# Altium project MB1364.PrjPcb (part 3 of 3)

## Sheet ST_LINK_V3E.SchDoc: STLINK_V3E
size A3; Date: Not used; ApprovedBy: Not used; CheckedBy: Not used; Author: Not used; CompanyName: STMicroelectronics; DrawnBy: Not used; Engineer: Not used; Organization: Not used; Address1: Not used; Address2: Not used; Address3: Not used; Address4: Not used; DocumentNumber: 10; Revision: Not used; SheetNumber: 9; SheetTotal: 9; CurrentTime: Not used; CurrentDate: Not used; Time: Not used; DocumentFullPathAndName: Not used; DocumentName: Not used; ModifiedDate: Not used; ImagePath: Not used; ProjectName: Not used; Application_BuildNumber: Not used
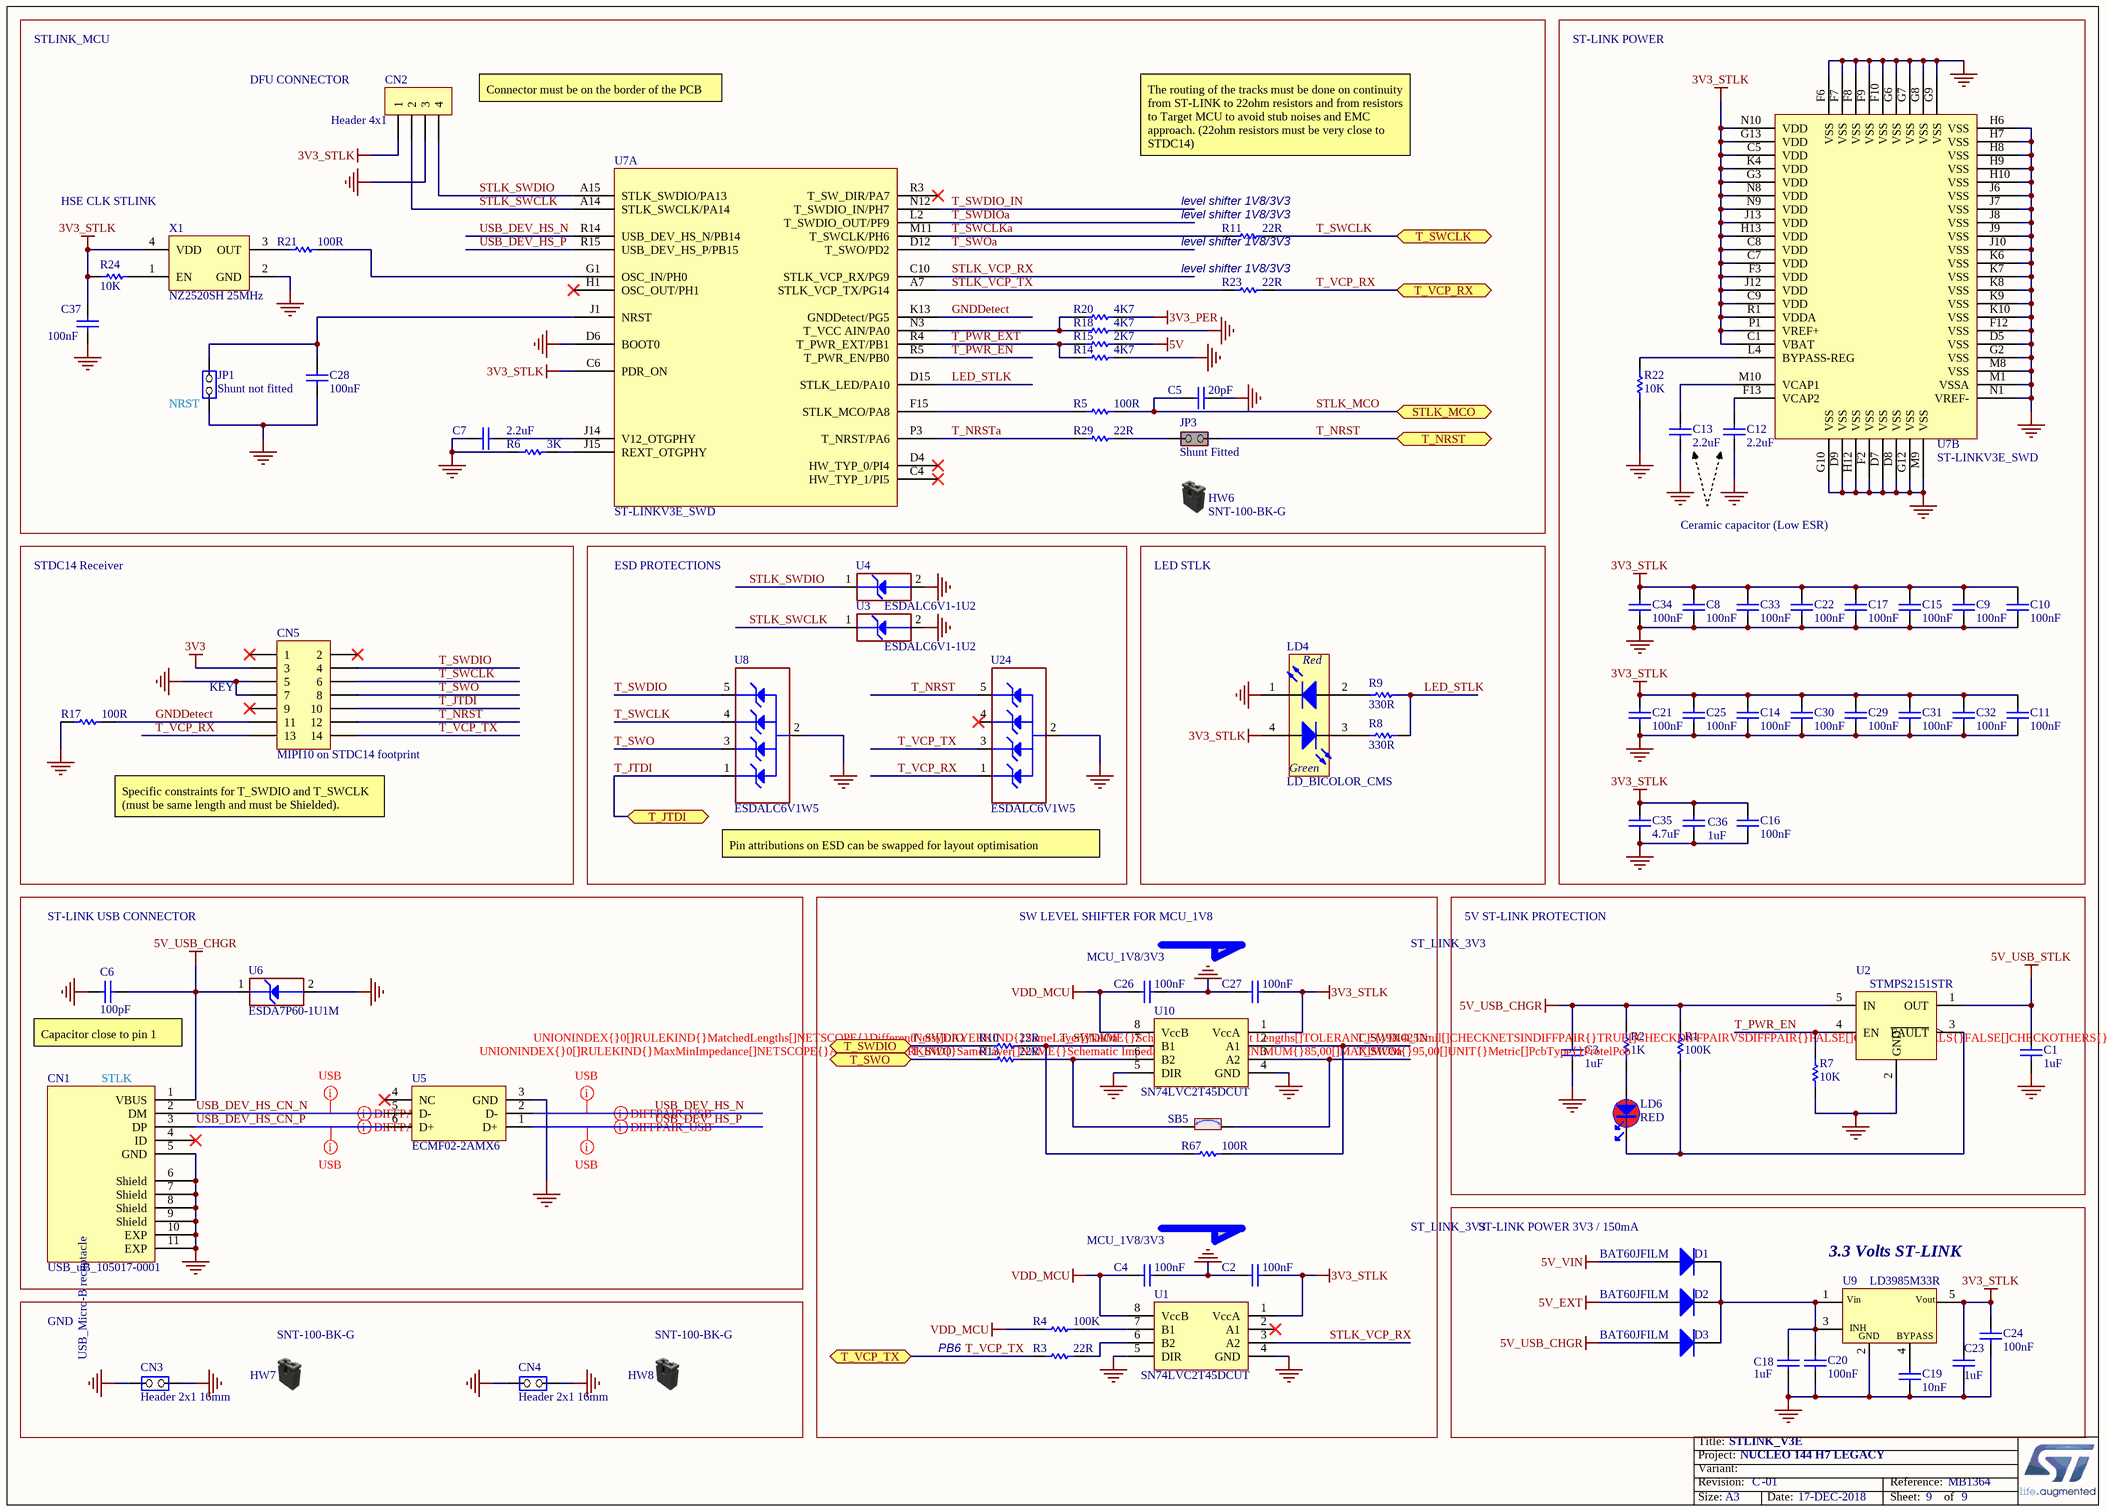
[diagram p8: ST_LINK_V3E.SchDoc]

### Parts
C1  value 1uF  [C0603]  (hidden comment: Capacitor)
C2  value 100nF  [C0603]  (hidden comment: Capacitor)
C3  value 1uF  [C0603]  (hidden comment: Capacitor)
C4  value 100nF  [C0603]  (hidden comment: Capacitor)
C5  value 20pF  [C0402]  (hidden comment: Capacitor)
C6  value 100pF  [C0402]  (hidden comment: Capacitor)
C7  value 2.2uF  [C0603]  (hidden comment: Capacitor)
C8  value 100nF  [C0402]  (hidden comment: Capacitor)
C9  value 100nF  [C0402]  (hidden comment: Capacitor)
C10  value 100nF  [C0402]  (hidden comment: Capacitor)
C11  value 100nF  [C0402]  (hidden comment: Capacitor)
C12  value 2.2uF  [C0603]  (hidden comment: Capacitor)
C13  value 2.2uF  [C0603]  (hidden comment: Capacitor)
C14  value 100nF  [C0402]  (hidden comment: Capacitor)
C15  value 100nF  [C0402]  (hidden comment: Capacitor)
C16  value 100nF  [C0402]  (hidden comment: Capacitor)
C17  value 100nF  [C0402]  (hidden comment: Capacitor)
C18  value 1uF  [C0603]  (hidden comment: Capacitor)
C19  value 10nF  [C0402]  (hidden comment: Capacitor)
C20  value 100nF  [C0402]  (hidden comment: Capacitor)
C21  value 100nF  [C0402]  (hidden comment: Capacitor)
C22  value 100nF  [C0402]  (hidden comment: Capacitor)
C23  value 1uF  [C0603]  (hidden comment: Capacitor)
C24  value 100nF  [C0402]  (hidden comment: Capacitor)
C25  value 100nF  [C0402]  (hidden comment: Capacitor)
C26  value 100nF  [C0603]  (hidden comment: Capacitor)
C27  value 100nF  [C0603]  (hidden comment: Capacitor)
C28  value 100nF  [C0402]  (hidden comment: Capacitor)
C29  value 100nF  [C0402]  (hidden comment: Capacitor)
C30  value 100nF  [C0402]  (hidden comment: Capacitor)
C31  value 100nF  [C0402]  (hidden comment: Capacitor)
C32  value 100nF  [C0402]  (hidden comment: Capacitor)
C33  value 100nF  [C0402]  (hidden comment: Capacitor)
C34  value 100nF  [C0402]  (hidden comment: Capacitor)
C35  value 4.7uF  [C0603]  (hidden comment: Capacitor)
C36  value 1uF  [C0603]  (hidden comment: Capacitor)
C37  value 100nF  [C0402]  (hidden comment: Capacitor)
CN1  value USB_uB_105017-0001  [CON_USBMICROB_MOLEX_105017-0001_H2P90]  (hidden comment: USB_uB_105017.0001)
CN2  Header 4x1  [CON_SAMTEC_TSW-104-07-G-S]
CN3  value Header 2x1 16mm  [CON_SAMTEC_TSW-102-09-X-S]  (hidden comment: Jumper_Header 2x1)
CN4  value Header 2x1 16mm  [CON_SAMTEC_TSW-102-09-X-S]  (hidden comment: Jumper_Header 2x1)
CN5  value MIPI10 on STDC14 footprint  [CON_STDC14_Receiver_MEDIUM_WITH_MIPI10_3D]  (hidden comment: Header 7x2)
D1  BAT60JFILM  [DIO_SOD323]
D2  BAT60JFILM  [DIO_SOD323]
D3  BAT60JFILM  [DIO_SOD323]
HW6  value SNT-100-BK-G  (hidden comment: Shunt Black 2.54mm)  (mechanical)
HW7  value SNT-100-BK-G  (hidden comment: Shunt Black 2.54mm)  (mechanical)
HW8  value SNT-100-BK-G  (hidden comment: Shunt Black 2.54mm)  (mechanical)
JP1  value Shunt not fitted  [CON_SAMTEC_TSW-102-07-G-S]  (hidden comment: Jumper_Header 2x1)
JP3  value Shunt Fitted  [CON_SAMTEC_TSW-102-07-G-S]  (hidden comment: Jumper_Header 2x1 Fitted)
LD4  LD_BICOLOR_CMS  [LED_BI-GR_HSMF-A201-A00J1]
LD6  value RED  [LED_0603_RED]  (hidden comment: LED_red)
R1  value 100K  [R0603]  (hidden comment: Resistor)
R2  value 1K  [R0603]  (hidden comment: Resistor)
R3  value 22R  [R0402]  (hidden comment: Resistor)
R4  value 100K  [R0603]  (hidden comment: Resistor)
R5  value 100R  [R0402]  (hidden comment: Resistor)
R6  value 3K  [R0402]  (hidden comment: Resistor)
R7  value 10K  [R0603]  (hidden comment: Resistor)
R8  value 330R  [R0603]  (hidden comment: Resistor)
R9  value 330R  [R0603]  (hidden comment: Resistor)
R10  value 22R  [R0402]  (hidden comment: Resistor)
R11  value 22R  [R0402]  (hidden comment: Resistor)
R13  value 22R  [R0402]  (hidden comment: Resistor)
R14  value 4K7  [R0402]  (hidden comment: Resistor)
R15  value 2K7  [R0402]  (hidden comment: Resistor)
R17  value 100R  [R0402]  (hidden comment: Resistor)
R18  value 4K7  [R0402]  (hidden comment: Resistor)
R20  value 4K7  [R0402]  (hidden comment: Resistor)
R21  value 100R  [R0402]  (hidden comment: Resistor)
R22  value 10K  [R0402]  (hidden comment: Resistor)
R23  value 22R  [R0402]  (hidden comment: Resistor)
R24  value 10K  [R0402]  (hidden comment: Resistor)
R29  value 22R  [R0402]  (hidden comment: Resistor)
R67  value 100R  [R0402]  (hidden comment: Resistor)
SB5  SB_ON  [SOLDER-BRIDGE_R0603-0R]  (value not drawn)
U1  SN74LVC2T45DCUT  [ICC_VSSOP8_DCU_R-PDSO-G8_2X2P30_P050]
U2  STMPS2151STR  [MOS_SOT23-5L]
U3  value ESDALC6V1-1U2  [ESD_ST0201]  (hidden comment: ESD-TRANSIL)
U4  value ESDALC6V1-1U2  [ESD_ST0201]  (hidden comment: ESD-TRANSIL)
U5  ECMF02-2AMX6  [ESD_QFN-6L_1P7X1P5_P050]
U6  value ESDA7P60-1U1M  [ESD_QFN2_1P6X1_P125]  (hidden comment: ESD-TRANSIL)
U7  ST-LINKV3E_SWD  [ICC_UFBGA201_176+25_10X10_P065]  (parts A,B of 2)
U8  ESDALC6V1W5  [ESD_SOT323-5L]
U9  LD3985M33R  [REG_SOT23-5L]
U10  SN74LVC2T45DCUT  [ICC_VSSOP8_DCU_R-PDSO-G8_2X2P30_P050]
U24  ESDALC6V1W5  [ESD_SOT323-5L]
X1  value NZ2520SH 25MHz  [OSC_NDK_NZ2520SB_4P]  (hidden comment: OSCILLATOR_4_PINS)

### Blocks framed on the sheet
ESD PROTECTIONS: U3 U4 U8 U24
LED STLK: LD4 R8 R9
5V ST-LINK PROTECTION: C1 C3 LD6 R1 R2 R7 U2
3.3 Volts ST-LINK: C18-C20 C23 C24 D1-D3 U9
GND: CN3 CN4 HW7 HW8

### Ports
STLK_MCO, T_JTDI (bidir), T_NRST, T_SWCLK, T_SWDIO, T_SWO, T_VCP_RX, T_VCP_TX

### Nets
3V3: CN5.3
3V3_PER: R20.2
3V3_STLK: C2.2 C8.2 C9.2 C10.2 C11.2 C14.2 C15.2 C16.2 C17.2 C21.2 C22.2 C23.2 C24.2 C25.2 C27.2 C29.2 C30.2 C31.2 C32.2 C33.2 C34.2 C35.2 C36.2 C37.2 CN2.1 LD4.4(YellowGreen_anode) R24.1 U1.1(VccA) U7.C1(VBAT) U7.C5(VDD) U7.C6(PDR_ON) U7.C7(VDD) U7.C8(VDD) U7.C9(VDD) U7.F3(VDD) U7.G3(VDD) U7.G13(VDD) U7.H13(VDD) U7.J12(VDD) U7.J13(VDD) U7.K4(VDD) U7.N8(VDD) U7.N9(VDD) U7.N10(VDD) U7.P1(VREF+) U7.R1(VDDA) U9.5(Vout) U10.1(VccA) X1.4(VDD)
5V: R15.1
5V_EXT: D2.1(A)
5V_USB_CHGR: C3.2 C6.2 CN1.1(VBUS) D3.1(A) R1.2 R2.2 U2.5(IN) U6.1(IO1)
5V_USB_STLK: C1.2 U2.1(OUT)
5V_VIN: D1.1(A)
GND: C1.1 C2.1 C3.1 C4.2 C5.1 C6.1 C7.1 C8.1 C9.1 C10.1 C11.1 C12.1 C13.1 C14.1 C15.1 C16.1 C17.1 C18.2 C19.1 C20.1 C21.1 C22.1 C23.1 C24.1 C25.1 C26.2 C27.1 C28.1 C29.1 C30.1 C31.1 C32.1 C33.1 C34.1 C35.1 C36.1 C37.1 CN1.5(GND) CN1.6(Shield) CN1.7(Shield) CN1.8(Shield) CN1.9(Shield) CN1.10(EXP) CN1.11(EXP) CN2.3 CN3.1(COMMON) CN3.2(NO) CN4.1(COMMON) CN4.2(NO) CN5.5 CN5.7 JP1.1(COMMON) LD4.1(RED_cathode) R6.1 R7.2 R14.1 R17.1 R18.2 R22.1 U1.4(GND) U1.5(DIR) U2.2(GND) U3.2(GND) U4.2(GND) U5.3(GND) U6.2(GND) U7.D5(VSS) U7.D6(BOOT0) U7.D7(VSS) U7.D8(VSS) U7.D9(VSS) U7.F2(VSS) U7.F6(VSS) U7.F7(VSS) U7.F8(VSS) U7.F9(VSS) U7.F10(VSS) U7.F12(VSS) U7.G2(VSS) U7.G6(VSS) U7.G7(VSS) U7.G8(VSS) U7.G9(VSS) U7.G10(VSS) U7.G12(VSS) U7.H6(VSS) U7.H7(VSS) U7.H8(VSS) U7.H9(VSS) U7.H10(VSS) U7.H12(VSS) U7.J6(VSS) U7.J7(VSS) U7.J8(VSS) U7.J9(VSS) U7.J10(VSS) U7.K6(VSS) U7.K7(VSS) U7.K8(VSS) U7.K9(VSS) U7.K10(VSS) U7.M1(VSSA) U7.M8(VSS) U7.M9(VSS) U7.N1(VREF-) U8.2(GND) U9.2(GND) U10.4(GND) U10.5(DIR) U24.2(GND) X1.2(GND)
VDD_MCU: C4.1 C26.1 R4.1 U1.8(VccB) U10.8(VccB)
GNDDetect: CN5.11 R17.2 U7.K13(GNDDetect/PG5)
LED_STLK: R8.2 R9.2 U7.D15(STLK_LED/PA10)
STLK_MCO: C5.2 R5.2 ; port STLK_MCO
STLK_SWCLK: CN2.2 U3.1(IO1) U7.A14(STLK_SWCLK/PA14)
STLK_SWDIO: CN2.4 U4.1(IO1) U7.A15(STLK_SWDIO/PA13)
STLK_VCP_RX: U1.3(A2) U7.C10(STLK_VCP_RX/PG9)
STLK_VCP_TX: R23.1 U7.A7(STLK_VCP_TX/PG14)
T_JTDI: CN5.10 U8.1(IO1) ; port T_JTDI  [project net PA15]
T_NRST: CN5.12 JP3.2(NO) U24.5(IO4) ; port T_NRST
T_NRSTa: R29.1 U7.P3(T_NRST/PA6)
T_PWR_EN: R7.1 U2.4(EN) U7.R5(T_PWR_EN/PB0)
T_PWR_EXT: R14.2 R15.2 U7.R4(T_PWR_EXT/PB1)
T_SWCLK: CN5.6 R11.2 U8.4(IO3) ; port T_SWCLK
T_SWCLKa: R11.1 U7.M11(T_SWCLK/PH6)
T_SWDIO: CN5.4 R10.1 U8.5(IO4) ; port T_SWDIO
T_SWDIO_IN: R67.2 U7.N12(T_SWDIO_IN/PH7) U10.2(A1)
T_SWDIOa: R10.2 R67.1 U7.L2(T_SWDIO_OUT/PF9) U10.7(B1)
T_SWO: CN5.8 R13.1 U8.3(IO2) ; port T_SWO
T_SWOa: SB5.1 U7.D12(T_SWO/PD2) U10.3(A2)
T_VCP_RX: CN5.13 R23.2 U24.1(IO1) ; port T_VCP_RX
T_VCP_TX: CN5.14 R3.1 U24.3(IO2) ; port T_VCP_TX
USB_DEV_HS_CN_N: CN1.2(DM) U5.5(D-)
USB_DEV_HS_CN_P: CN1.3(DP) U5.6(D+)
USB_DEV_HS_N: U5.2(D-) U7.R14(USB_DEV_HS_N/PB14)
USB_DEV_HS_P: U5.1(D+) U7.R15(USB_DEV_HS_P/PB15)
NetC7_2: C7.2 U7.J14(V12_OTGPHY)
NetC12_2: C12.2 U7.F13(VCAP2)
NetC13_2: C13.2 U7.M10(VCAP1)
NetC18_1: C18.1 C20.2 D1.2(K) D2.2(K) D3.2(K) U9.1(Vin) U9.3(CE)
NetC19_2: C19.2 U9.4(BYPASS)
NetC28_2: C28.2 JP1.2(NO) U7.J1(NRST)
NetJP3_1: JP3.1(COMMON) R29.2
NetLD4_2: LD4.2(Red_anode) R9.1
NetLD4_3: LD4.3(YellowGreen_cathode) R8.1
NetLD6_1: LD6.1 R2.1
NetLD6_2: LD6.2 R1.1 U2.3(~{FAULT})
NetR3_2: R3.2 U1.6(B2)
NetR4_2: R4.2 U1.7(B1)
NetR5_1: R5.1 U7.F15(STLK_MCO/PA8)
NetR6_2: R6.2 U7.J15(REXT_OTGPHY)
NetR13_2: R13.2 SB5.2 U10.6(B2)
NetR18_1: R18.1 R20.1 U7.N3(T_VCC_AIN/PA0)
NetR21_1: R21.1 X1.3(OUT)
NetR21_2: R21.2 U7.G1(OSC_IN/PH0)
NetR22_2: R22.2 U7.L4(BYPASS-REG)
NetR24_2: R24.2 X1.1(EN)

Not connected (* = marked no-connect by the designer): CN1 4(ID)*; CN5 1* 2* 9*; U1 2(A1)*; U5 4(NC)*; U7 C4(HW_TYP_1/PI5)* D4(HW_TYP_0/PI4)* H1(OSC_OUT/PH1)* R3(T_SW_DIR/PA7)*; U24 4(IO3)*

### Layout directives
differential pair; rule Impedance Constraint [Min = 85.00    Max = 95.00    ]: USB_DEV_HS_CN_N, USB_DEV_HS_CN_P, USB_DEV_HS_N, USB_DEV_HS_P
rule Undefined; rule Matched Net Lengths [Tolerance = 2.5mm]; rule Impedance Constraint [Min = 85.00    Max = 95.00    ]: USB_DEV_HS_N
rule Undefined; rule Matched Net Lengths [Tolerance = 0.2mm]; rule Impedance Constraint [Min = 85.00    Max = 95.00    ]: USB_DEV_HS_CN_N, USB_DEV_HS_CN_P, USB_DEV_HS_P

### Notes on the sheet
- STLINK_MCU
- ST-LINK POWER
- DFU CONNECTOR
- (near CN2) Connector must be on the border of the PCB
- The routing of the tracks must be done on continuity from ST-LINK to 22ohm resistors and from resistors to Target MCU to avoid stub noises and EMC approach. (22ohm resistors must be very close to STDC14)
- HSE CLK STLINK
- level shifter 1V8/3V3
- (near JP1) NRST
- STDC14 Receiver
- Ceramic capacitor (Low ESR)
- (near CN5) KEY
- Specific constraints for T_SWDIO and T_SWCLK (must be same length and must be Shielded).
- Pin attributions on ESD can be swapped for layout optimisation
- ST-LINK USB CONNECTOR
- SW LEVEL SHIFTER FOR MCU_1V8
- MCU_1V8/3V3
- ST_LINK_3V3
- (near C6) Capacitor close to pin 1
- (near CN1) STLK
- ST-LINK POWER 3V3 / 150mA
- PB6
- Title:
- Project:
- Size:
- Revision:
- Variant:
- A3
- -
- Date:
- Reference:
- Sheet:
- of
- (in symbol MCD-00028) USB_Micro-B receptacle
- (in symbol MCD-00051) Red; Green
- (in symbol MCD-00086) INH

### Library data of the parts
C1 C3 C18 = MCD-00238: Capacitor, MLCC, 1uF, 6V3, X5R, 10%, 0603, T=0,8mm; Manufacturer_Part_Number: CC0603KRX5R5BB105; Manufacturer: YAGEO; Provided_By: SUBCO; ECCN_US: EAR99; ECCN_EU: NEC; Internal_Part_Number: MCD-00238; ComponentLink1Description: Datasheet; Status: Released; Part_Type: Capacitor; Package: C0603; ComponentLink1URL: http://tunmcdsvn.tun.st.com/Component_Datasheet_Library/Trunk/Capacitors/Yageo_Multilayer_capacitor_X5R_series_100pF_to_100uF
C2 C4 C26 C27 = MCD-00237: Capacitor, MLCC, 100nF, 6V3, X5R, 10%, 0603, T=0,8mm; Manufacturer_Part_Number: CC0603KRX5R5BB104; Manufacturer: YAGEO; Provided_By: SUBCO; ECCN_US: EAR99; ECCN_EU: NEC; Internal_Part_Number: MCD-00237; ComponentLink1Description: Datasheet; Status: Released; Part_Type: Capacitor; Package: C0603; ComponentLink1URL: http://tunmcdsvn.tun.st.com/Component_Datasheet_Library/Trunk/Capacitors/Yageo_Multilayer_capacitor_X5R_series_100pF_to_100uF
C5 = MCD-00016: Capacitor, MLCC, 20pF, 50V, NPO, 5%, 0402, T=0,5mm; Manufacturer_Part_Number: CC0402JRNPO9BN200; Manufacturer: YAGEO; Provided_By: SUBCO; ECCN_US: EAR99; ECCN_EU: NEC; Internal_Part_Number: MCD-00016; Status: Released; Package: C0402; ComponentLink1Description: Datasheet; Part_Type: Capacitor; ComponentLink1URL: http://tunmcdsvn.tun.st.com/Component_Datasheet_Library/Trunk/Capacitors/Yageo_Capacitor_NP0_16V-to-50V
C6 = MCD-00205: Capacitor, MLCC, 100pF, 50V, NPO, 5%, 0402, T=0,5mm; Manufacturer_Part_Number: CC0402JRNPO9BN101; Manufacturer: YAGEO; Provided_By: SUBCO; ECCN_US: EAR99; ECCN_EU: NEC; Internal_Part_Number: MCD-00205; Status: Released; Part_Type: Capacitor; Package: C0402; ComponentLink1Description: Datasheet; ComponentLink1URL: http://tunmcdsvn.tun.st.com/Component_Datasheet_Library/Trunk/Capacitors/Yageo_Capacitor_NP0_16V-to-50V
C7 C12 C13 = MCD-00012: Capacitor, MLCC, 2.2uF, 10V, X5R, 10%, 0603, T=0,8mm; Manufacturer_Part_Number: CC0603KRX5R6BB225; Manufacturer: YAGEO; Alternate_Manufacturer_Part_Number: C0603C225K8PACTU; Alternate_Manufacturer: KEMET; Provided_By: SUBCO; ECCN_US: EAR99; ECCN_EU: NEC; Internal_Part_Number: MCD-00012; Status: Released; Package: C0603; ComponentLink1Description: Datasheet; Part_Type: Capacitor; ComponentLink1URL: http://tunmcdsvn.tun.st.com/Component_Datasheet_Library/Trunk/Capacitors/Yageo_Multilayer_capacitor_X5R_series_100pF_to_100uF
C8-C11 C14-C17 C20-C22 C24 C25 C28-C34 C37 = MCD-00102: Capacitor, MLCC, 100nF, 16V, X7R, 10%, 0402, T=0,5mm; Manufacturer_Part_Number: CC0402KRX7R7BB104; Manufacturer: YAGEO; Alternate_Manufacturer_Part_Number: GCM155R71C104KA55D; Alternate_Manufacturer: MURATA; Provided_By: SUBCO; ECCN_US: EAR99; ECCN_EU: NEC; Internal_Part_Number: MCD-00102; Status: Released; Package: C0402; ComponentLink1Description: Datasheet; Part_Type: Capacitor; ComponentLink1URL: http://tunmcdsvn.tun.st.com/Component_Datasheet_Library/Trunk/Capacitors/Yageo_Multilayer_Capacitor_X7R_series_100pF_to_22uF
C19 = MCD-00011: Capacitor, MLCC, 10nF, 16V, X7R, 10%, 0402, T=0.5mm; Manufacturer_Part_Number: CC0402KRX7R7BB103; Manufacturer: YAGEO; Provided_By: SUBCO; ECCN_US: EAR99; ECCN_EU: NEC; Internal_Part_Number: MCD-00011; Status: Released; Part_Type: Capacitor; Package: C0402; ComponentLink1Description: Datasheet; ComponentLink1URL: http://tunmcdsvn.tun.st.com/Component_Datasheet_Library/Trunk/Capacitors/Yageo_Multilayer_Capacitor_X7R_series_100pF_to_22uF
C23 C36 = MCD-00010: Capacitor, MLCC, 1uF, 16V, X5R, 10%, 0603, T=0,8mm; Manufacturer_Part_Number: CC0603KRX5R7BB105; Manufacturer: YAGEO; Provided_By: SUBCO; ECCN_US: EAR99; ECCN_EU: NEC; Internal_Part_Number: MCD-00010; Status: Released; Package: C0603; ComponentLink1Description: Datasheet; Part_Type: Capacitor; ComponentLink1URL: http://tunmcdsvn.tun.st.com/Component_Datasheet_Library/Trunk/Capacitors/Yageo_Multilayer_capacitor_X5R_series_100pF_to_100uF
C35 = MCD-00009: Capacitor, MLCC, 4.7uF, 16V, X5R, 10%, 0603, T=0.8mm; Manufacturer_Part_Number: CC0603KRX5R7BB475; Manufacturer: YAGEO; Provided_By: SUBCO; ECCN_US: EAR99; ECCN_EU: NEC; Internal_Part_Number: MCD-00009; Status: Released; Part_Type: Capacitor; Package: C0603; ComponentLink1Description: Datasheet; ComponentLink1URL: http://tunmcdsvn.tun.st.com/Component_Datasheet_Library/Trunk/Capacitors/Yageo_Multilayer_capacitor_X5R_series_100pF_to_100uF
CN1 = MCD-00028: USB-MICRO-B, 0.65mm, RA, SMT, Bottom Mount,; Manufacturer_Part_Number: 1050170001; Manufacturer: MOLEX; Part_Type: Connector; Provided_By: SUBCO; Internal_Part_Number: MCD-00028; Status: Released; ComponentLink1Description: Datasheet; ComponentLink1URL: http://tunmcdsvn.tun.st.com/Component_Datasheet_Library/Trunk/Connectors/Molex_Connector-USB-microB_105017-0001; ECCN_US: n/a; ECCN_EU: n/a
CN2 = MCD-00029: Header, 4x1, 2,54mm, VR, TH, Height 5.84mm/2.54mm; Manufacturer_Part_Number: TSW-104-07-x-S; Manufacturer: SAMTEC; Part_Type: Connector; Provided_By: SUBCO; Internal_Part_Number: MCD-00029; Value: Header 4x1; Status: Released; ComponentLink1Description: Datasheet; ComponentLink1URL: http://tunmcdsvn.tun.st.com/Component_Datasheet_Library/Trunk/Connectors/Samtec_TSW-HTSW-series; ECCN_US: n/a; ECCN_EU: n/a
CN3 CN4 = MCD-00214: Header, 2x1, 2,54mm, VR, TH, Height 5.84mm/10.16mm; Part_Type: Connector; Manufacturer_Part_Number: TSW-102-09-x-S; Manufacturer: SAMTEC; Provided_By: SUBCO; Internal_Part_Number: MCD-00214; Status: Released; ComponentLink1Description: Datasheet; ComponentLink1URL: http://tunmcdsvn.tun.st.com/Component_Datasheet_Library/Trunk/Connectors/Samtec_TSW-HTSW-series; ECCN_US: n/a; ECCN_EU: n/a
CN5 = MCD-01226: Header 5x2, 1.27mm, Dual row, Straight, Surface mount, vertical male connector. 3.05mm lead. Mates with FFSD connector. Footprint compatible with FTSH-107-01-L-DV,-K,-A,-P,-ES (STDC14 MEDIUM); Manufacturer_Part_Number: FTSH-105-01-L-DV-K; Manufacturer: SAMTEC; Alternate_Manufacturer_Part_Number: P127B-2x05MGF-079-1A; Alternate_Manufacturer: JIUBABA; Provided_By: SUBCO; Internal_Part_Number: MCD-01226; Status: Released; Part_Type: Connector; ComponentLink1Description: Datasheet; ComponentLink1URL: http://tunmcdsvn.tun.st.com/Component_Datasheet_Library/Trunk/Connectors/Samtec_FTSH_smt_series; ECCN_US: n/a; ECCN_EU: n/a
D1-D3 = MCD-00034: Manufacturer: STMICROELECTRONICS; Part_Type: Diode; BMS_Part_Number: 9151097; Provided_By: SUBCO with ST control; ECCN_US: EAR99; ECCN_EU: NEC; Internal_Part_Number: MCD-00034; Value: BAT60JFILM; Manufacturer_Part_Number: BAT60JFILM; ComponentLink1Description: Datasheet; Status: Released; ComponentLink1URL: http://tunmcdsvn.tun.st.com/Component_Datasheet_Library/Trunk/Diodes/STM_Diode_BAT60JFILM-SOD323
HW6-HW8 = MCD-00043: SHUNT 2.54mm BLACK; Manufacturer: SAMTEC; Part_Type: Mechanical; Alternate_Manufacturer_Part_Number: 316102S111A; Alternate_Manufacturer: JIUBABA; Provided_By: SUBCO; Internal_Part_Number: MCD-00043; Manufacturer_Part_Number: SNT-100-BK-G; ComponentLink1Description: Datasheet; Status: Released; ComponentLink1URL: http://tunmcdsvn.tun.st.com/Component_Datasheet_Library/Trunk/Connectors/Samtec_Shunt_Jumper_SNT100; ECCN_US: n/a; ECCN_EU: n/a
JP1 = MCD-00045: Header, 2x1, 2,54mm, VR, TH, Height 5.84mm/2.54mm; Part_Type: Connector; Manufacturer_Part_Number: TSW-102-07-x-S; Manufacturer: SAMTEC; Alternate_Manufacturer_Part_Number: 313102S111116;313102S111116; Alternate_Manufacturer: JIUBABA; LIANYI; Provided_By: SUBCO; Internal_Part_Number: MCD-00045; Status: Released; ComponentLink1Description: Datasheet; ComponentLink1URL: http://tunmcdsvn.tun.st.com/Component_Datasheet_Library/Trunk/Connectors/Samtec_TSW-HTSW-series; ECCN_US: n/a; ECCN_EU: n/a
JP3 = MCD-00683: Header, 2x1, 2,54mm, VR, TH, Height 5.84mm/2.54mm - Shunt Fitted by default; Part_Type: Connector; Manufacturer_Part_Number: TSW-102-07-x-S; Manufacturer: SAMTEC; Alternate_Manufacturer_Part_Number: 313102S111116; Alternate_Manufacturer: LIANYI; Provided_By: SUBCO; Internal_Part_Number: MCD-00683; Status: Released; ComponentLink1Description: Datasheet; ComponentLink1URL: http://tunmcdsvn.tun.st.com/Component_Datasheet_Library/Trunk/Connectors/Samtec_TSW-HTSW-series; ECCN_US: n/a; ECCN_EU: n/a
LD4 = MCD-00051: LED Bicolor; Part_Type: Display; Manufacturer_Part_Number: HSMF-A201-A00J1; Manufacturer: AVAGO TECHNOLOGIES; Alternate_Manufacturer_Part_Number: LE-RGW35280; Alternate_Manufacturer: EVERLUCK; Provided_By: SUBCO; ECCN_US: EAR99; ECCN_EU: NEC; Internal_Part_Number: MCD-00051; Value: LD_BICOLOR_CMS; Status: Released; ComponentLink1Description: Datasheet; ComponentLink1URL: http://tunmcdsvn.tun.st.com/Component_Datasheet_Library/Trunk/Display/Avago_LED-SMC_HSMx-A2xx-02Feb2012
LD6 = MCD-00049: LED, Red, 0603; Manufacturer_Part_Number: 19-213-R6C-AP1Q2B/3T; Manufacturer: EVERLIGHT; Part_Type: Display; Provided_By: SUBCO; ECCN_US: EAR99; ECCN_EU: NEC; Internal_Part_Number: MCD-00049; ComponentLink1Description: Datasheet; Status: Released; ComponentLink1URL: http://tunmcdsvn.tun.st.com/Component_Datasheet_Library/Trunk/Display/Everlight_SMD-LED-RED_19-213-R6C-AP1Q2B-3T-V3.doc; Package: LED 0603
R1 R4 = MCD-00223: Resistor,100K,0603,1%,1/10W; Manufacturer_Part_Number: RC0603FR-07100KL; Manufacturer: YAGEO; Provided_By: SUBCO; ECCN_US: EAR99; ECCN_EU: NEC; Internal_Part_Number: MCD-00223; Status: Released; Part_Type: Resistor; Package: R0603; ComponentLink1Description: Datasheet; ComponentLink1URL: http://tunmcdsvn.tun.st.com/Component_Datasheet_Library/Trunk/Resistors/Yageo_Resistor_RC0603-series
R2 = MCD-00070: Resistor,1K,0603,1%,1/10W; Manufacturer_Part_Number: RC0603FR-071KL; Manufacturer: YAGEO; Provided_By: SUBCO; ECCN_US: EAR99; ECCN_EU: NEC; Internal_Part_Number: MCD-00070; ComponentLink1Description: Datasheet; Status: Released; Part_Type: Resistor; Package: R0603; ComponentLink1URL: http://tunmcdsvn.tun.st.com/Component_Datasheet_Library/Trunk/Resistors/Yageo_Resistor_RC0603-series
R3 R10 R11 R13 R23 R29 = MCD-00189: Resistor,22R,0402,1%,1/16W; Manufacturer_Part_Number: RC0402FR-0722RL; Manufacturer: YAGEO; Provided_By: SUBCO; ECCN_US: EAR99; ECCN_EU: NEC; Internal_Part_Number: MCD-00189; Status: Released; Part_Type: Resistor; ComponentLink1Description: Datasheet; Package: R0402; ComponentLink1URL: http://tunmcdsvn.tun.st.com/Component_Datasheet_Library/Trunk/Resistors/Yageo_Resistor_RC0402-series
R5 R17 R21 R67 = MCD-00119: Resistor,100R,0402,1%,1/16W; Manufacturer_Part_Number: RC0402FR-07100RL; Manufacturer: YAGEO; Provided_By: SUBCO; ECCN_US: EAR99; ECCN_EU: NEC; Internal_Part_Number: MCD-00119; Status: Released; Part_Type: Resistor; ComponentLink1Description: Datasheet; Package: R0402; ComponentLink1URL: http://tunmcdsvn.tun.st.com/Component_Datasheet_Library/Trunk/Resistors/Yageo_Resistor_RC0402-series
R6 = MCD-00185: Resistor,3K,0402,1%,1/16W; Manufacturer_Part_Number: RC0402FR-073KL; Manufacturer: YAGEO; Provided_By: SUBCO; ECCN_US: EAR99; ECCN_EU: NEC; Internal_Part_Number: MCD-00185; Status: Released; ComponentLink1Description: Datasheet; Part_Type: Resistor; Package: R0402; ComponentLink1URL: http://tunmcdsvn.tun.st.com/Component_Datasheet_Library/Trunk/Resistors/Yageo_Resistor_RC0402-series
R7 = MCD-00220: Resistor,10K,0603,1%,1/10W; Manufacturer_Part_Number: RC0603FR-0710KL; Manufacturer: YAGEO; Provided_By: SUBCO; ECCN_US: EAR99; ECCN_EU: NEC; Internal_Part_Number: MCD-00220; ComponentLink1Description: Datasheet; Status: Released; Part_Type: Resistor; Package: R0603; ComponentLink1URL: http://tunmcdsvn.tun.st.com/Component_Datasheet_Library/Trunk/Resistors/Yageo_Resistor_RC0603-series
R8 R9 = MCD-00197: Resistor,330R,0603,1%,1/10W; Manufacturer_Part_Number: RC0603FR-07330RL; Manufacturer: YAGEO; BMS_Part_Number: 9129729; Provided_By: SUBCO; ECCN_US: EAR99; ECCN_EU: NEC; Internal_Part_Number: MCD-00197; Status: Released; ComponentLink1Description: Datasheet; Part_Type: Resistor; Package: R0603; ComponentLink1URL: http://tunmcdsvn.tun.st.com/Component_Datasheet_Library/Trunk/Resistors/Yageo_Resistor_RC0603-series
R14 R18 R20 = MCD-00065: Resistor,4K7,0402,1%,1/16W; Manufacturer_Part_Number: RC0402FR-074K7L; Manufacturer: YAGEO; Alternate_Manufacturer_Part_Number: RT0402FRE074K7L; Provided_By: SUBCO; ECCN_US: EAR99; ECCN_EU: NEC; Internal_Part_Number: MCD-00065; Status: Released; ComponentLink1Description: Datasheet; Alternate_Manufacturer: YAGEO; Part_Type: Resistor; Package: R0402; ComponentLink1URL: http://tunmcdsvn.tun.st.com/Component_Datasheet_Library/Trunk/Resistors/Yageo_Resistor_RC0402-series
R15 = MCD-00055: Resistor,2K7,0402,1%,1/16W; Manufacturer_Part_Number: RC0402FR-072K7L; Manufacturer: YAGEO; Provided_By: SUBCO; ECCN_US: EAR99; ECCN_EU: NEC; Internal_Part_Number: MCD-00055; Status: Released; ComponentLink1Description: Datasheet; Part_Type: Resistor; Package: R0402; ComponentLink1URL: http://tunmcdsvn.tun.st.com/Component_Datasheet_Library/Trunk/Resistors/Yageo_Resistor_RC0402-series
R22 R24 = MCD-00053: Resistor,10K,0402,1%,1/16W; Manufacturer_Part_Number: RC0402FR-0710KL; Manufacturer: YAGEO; Provided_By: SUBCO; ECCN_US: EAR99; ECCN_EU: NEC; Internal_Part_Number: MCD-00053; Status: Released; ComponentLink1Description: Datasheet; Part_Type: Resistor; Package: R0402; ComponentLink1URL: http://tunmcdsvn.tun.st.com/Component_Datasheet_Library/Trunk/Resistors/Yageo_Resistor_RC0402-series
SB5 = MCD-00071: Solder Bridge ON; Part_Type: Mechanical; Manufacturer_Part_Number: RC0603JR-070RL; Manufacturer: YAGEO; Provided_By: SUBCO; Internal_Part_Number: MCD-00071; Status: Released; ComponentLink1Description: Datasheet; Package: SB0603; ComponentLink1URL: http://tunmcdsvn.tun.st.com/Component_Datasheet_Library/Trunk/Resistors/Yageo_Resistor_RC0603-series; ECCN_US: n/a; ECCN_EU: n/a
U1 U10 = MCD-00264: Dual bit dual supply bus transceiver; Part_Type: IC; Manufacturer: TEXAS INSTRUMENTS; Provided_By: SUBCO; ECCN_US: EAR99; ECCN_EU: NEC; Internal_Part_Number: MCD-00264; Value: SN74LVC2T45DCUT; Status: Released; Manufacturer_Part_Number: SN74LVC2T45DCUT; ComponentLink1Description: Datasheet; ComponentLink1URL: http://tunmcdsvn.tun.st.com/Component_Datasheet_Library/Trunk/IC/TI_Dual_bit_tranceiver_SN74LVC2T45
U2 = MCD-00159: 500mA, Enhanced single channel power switches with active high enable pin; Part_Type: IC; Manufacturer: STMICROELECTRONICS; Alternate_Manufacturer_Part_Number: TPS2051C; Alternate_Manufacturer: TEXAS INSTRUMENTS; BMS_Part_Number: 9159009; Provided_By: SUBCO with ST control; ECCN_US: EAR99; ECCN_EU: NEC; Internal_Part_Number: MCD-00159; Value: STMPS2151STR; Status: Released; Manufacturer_Part_Number: STMPS2151STR; ComponentLink1Description: Datasheet; ComponentLink1URL: http://tunmcdsvn.tun.st.com/Component_Datasheet_Library/Trunk/IC/STM_PWR-Switch_STMPS2151STR
U3 U4 = MCD-00170: ESD protection 6V1; Part_Type: Diode; Manufacturer: STMICROELECTRONICS; BMS_Part_Number: 9151132; Provided_By: SUBCO with ST control; ECCN_US: EAR99; ECCN_EU: NEC; Internal_Part_Number: MCD-00170; Status: Released; Manufacturer_Part_Number: ESDALC6V1-1U2; ComponentLink1Description: Datasheet; ComponentLink1URL: http://tunmcdsvn.tun.st.com/Component_Datasheet_Library/Trunk/Diodes/STM_ESD_ESDALC6V1-1U2
U5 = MCD-00649: Common mode filter with ESD protection for USB 2.0 interface; Part_Type: Diode; Manufacturer: STMICROELECTRONICS; BMS_Part_Number: 9151138; Provided_By: SUBCO with ST control; ECCN_US: EAR99; ECCN_EU: NEC; Internal_Part_Number: MCD-00649; Value: ECMF02-2AMX6; Status: Released; Manufacturer_Part_Number: ECMF02-2AMX6; ComponentLink1Description: Datasheet; ComponentLink1URL: http://tunmcdsvn.tun.st.com/Component_Datasheet_Library/Trunk/Diodes/STM_ESD_ECMF02-2AMX6
U6 = MCD-00251: High power transient voltage suppressor, 7V breakdown; Part_Type: Diode; Manufacturer: STMICROELECTRONICS; BMS_Part_Number: 9179042; Provided_By: SUBCO with ST control; ECCN_US: EAR99; ECCN_EU: NEC; Internal_Part_Number: MCD-00251; Status: Released; Manufacturer_Part_Number: ESDA7P60-1U1M; ComponentLink1Description: Datasheet; ComponentLink1URL: http://tunmcdsvn.tun.st.com/Component_Datasheet_Library/Trunk/Diodes/STM_ESD_ESDA7P60-1U1M
U7 = MCD-00596: STM32F723IEK  (STM32F7) BGA176; Part_Type: IC; Manufacturer_Part_Number: STM32F723IEK6; Manufacturer: STMICROELECTRONICS; BMS_Part_Number: 9175300; Provided_By: SUBCO with ST control; ECCN_US: 3A991A2; ECCN_EU: NEC; Internal_Part_Number: MCD-00596; Value: ST-LINKV3E_SWD; Status: Released; ComponentLink1Description: Datasheet; ComponentLink1URL: http://tunmcdsvn.tun.st.com/Component_Datasheet_Library/Trunk/IC/BGA176+25L_10x10x0.6_pitch0.65
U8 U24 = MCD-00136: Dual Transil array for ESD protection; Part_Type: Diode; Manufacturer: STMICROELECTRONICS; BMS_Part_Number: 9151112; Provided_By: SUBCO with ST control; ECCN_US: EAR99; ECCN_EU: NEC; Internal_Part_Number: MCD-00136; Value: ESDALC6V1W5; Status: Released; Manufacturer_Part_Number: ESDALC6V1W5; ComponentLink1Description: Datasheet; ComponentLink1URL: http://tunmcdsvn.tun.st.com/Component_Datasheet_Library/Trunk/Diodes/STM_ESD_ESDALC6V1W5
U9 = MCD-00086: Ultra low drop-low noise BiCMOS voltage, regulators low ESR capacitors compatible; Manufacturer: STMICROELECTRONICS; Part_Type: IC; BMS_Part_Number: 9176161; Provided_By: SUBCO with ST control; ECCN_US: EAR99; ECCN_EU: NEC; Internal_Part_Number: MCD-00086; Value: LD3985M33R; Status: Released; Manufacturer_Part_Number: LD3985M33R; ComponentLink1Description: Datasheet; ComponentLink1URL: http://tunmcdsvn.tun.st.com/Component_Datasheet_Library/Trunk/IC/STM_LDO_LD3985
X1 = MCD-00597: Oscillator 25Mhz, +-50ppm, Vcc:3.3V typ, square wave: [0.1Vcc;0.9Vcc], Enable pin, SMD; Manufacturer_Part_Number: NZ2520SH 25MHz END4869C; Manufacturer: NDK; Alternate_Manufacturer_Part_Number: NZ2520SB 25MHz END4869B; Part_Type: Crystal_Osc; BMS_Part_Number: 9157050; Provided_By: SUBCO; ECCN_US: EAR99; ECCN_EU: NEC; Internal_Part_Number: MCD-00597; Status: Released; Alternate_Manufacturer: NDK; ComponentLink1Description: Datasheet; ComponentLink1URL: http://tunmcdsvn.tun.st.com/Component_Datasheet_Library/Trunk/Crystal_Osc/NDK_NZ2520SH 25MHz END4869C

## Nets that join several sheets
1V8_VDD: Power_Board (SB80.2), MCU_144_POWER (JP5.3)
3V3: Connectors (CN8.7 CN11.16 SB20.1), Power_Board (JP4.1 SB1.1 SB2.2 TP1.1), ST_LINK_V3E (CN5.3)
3V3_PER: Connectors (R26.2 R27.2 R28.2 SB10.1), Power_Board (SB1.2), USB (R65.2 R66.2), Ethernet (L1.2), ST_LINK_V3E (R20.2)
3V3_VDD: Connectors (CN11.5), Power_Board (JP4.2 SB6.1), MCU_144_IOs (B1.1 B1.2 R34.2), MCU_144_POWER (JP5.1 SB13.1)
5V: Connectors (CN8.9 CN11.18), Power_Board (8 pins), USB (U18.5), ST_LINK_V3E (R15.1)
5V_EXT: Connectors (CN11.6), Power_Board (JP2.5), ST_LINK_V3E (D2.1)
5V_USB_CHGR: Power_Board (JP2.7), ST_LINK_V3E (8 pins)
5V_USB_STLK: Connectors (CN12.8), Power_Board (JP2.1), ST_LINK_V3E (C1.2 U2.1)
5V_VIN: Power_Board (C41.2 JP2.3 U12.2 U12.4), ST_LINK_V3E (D1.1)
AGND: Connectors (C65.1 CN10.3 CN12.32), MCU_144_POWER (6 pins)
GND: Connectors (30 pins), Power_Board (15 pins), MCU_144_IOs (15 pins), MCU_144_POWER (26 pins), USB (13 pins), Ethernet (22 pins), ST_LINK_V3E (111 pins)
VBAT: Connectors (CN11.33), MCU_144_POWER (C61.2 SB52.1 U14.6)
VDD_MCU: Connectors (SB11.1), MCU_144_POWER (26 pins), USB (R56.1 R61.1), Ethernet (7 pins), ST_LINK_V3E (5 pins)
VDDA: Connectors (CN10.1), MCU_144_POWER (6 pins)
VIN: Connectors (CN8.15 CN11.24), Power_Board (C42.2 U12.3)
VREFP: Connectors (C65.2 SB42.2), MCU_144_POWER (C58.2 C64.1 R36.2 U14.32)
ARD_D0_RX: Connectors (CN10.16), MCU_144_IOs (SB66.1 SB68.2)
ARD_D1_TX: Connectors (CN10.14), MCU_144_IOs (SB8.1 SB18.2)
BOOT0: Connectors (CN11.7), MCU_144_IOs (R33.1 U14.138)
NRST: Connectors (CN8.5 CN11.14), MCU_144_IOs (5 pins), Ethernet (SB74.1)
PA0: Connectors (CN11.28 SB75.1), MCU_144_IOs (SB58.2 U14.34)
PA1: Connectors (CN11.30), MCU_144_IOs (SB57.1 U14.35)
PA2: Connectors (CN12.35), MCU_144_IOs (SB72.1 U14.36)
PA3: Connectors (CN9.1 CN12.37), MCU_144_IOs (U14.37)
PA4: Connectors (CN7.17 CN11.32), MCU_144_IOs (U14.40)
PA5: Connectors (CN7.10 CN12.11 SB47.1), MCU_144_IOs (U14.41)
PA6: Connectors (CN7.12 CN12.13), MCU_144_IOs (U14.42)
PA7: Connectors (CN12.15 SB33.2), MCU_144_IOs (SB31.1 U14.43)
PA8: Connectors (CN12.23), MCU_144_IOs (TP4.1 U14.100)
PA9: Connectors (CN12.21), MCU_144_IOs (SB23.1 U14.101)
PA10: Connectors (CN12.33), MCU_144_IOs (SB24.1 U14.102)
PA11: Connectors (SB16.2), MCU_144_IOs (SB21.1 U14.103)
PA12: Connectors (SB17.2), MCU_144_IOs (SB22.1 U14.104)
PA13: Connectors (CN11.13), MCU_144_IOs (U14.105)
PA14: Connectors (CN11.15), MCU_144_IOs (U14.109)
PA15: Connectors (CN7.9 CN11.17), MCU_144_IOs (U14.110), ST_LINK_V3E (CN5.10 U8.1)
PB0: Connectors (CN10.31 CN11.34 SB39.1), MCU_144_IOs (U14.46)
PB1: Connectors (CN9.7 CN12.24), MCU_144_IOs (U14.47)
PB2: Connectors (CN12.22 SB63.1 SB69.1), MCU_144_IOs (U14.48)
PB3: Connectors (CN12.31 SB26.1), MCU_144_IOs (SB32.2 U14.133)
PB4: Connectors (CN7.19 CN12.27), MCU_144_IOs (U14.134)
PB5: Connectors (CN7.13 CN12.29 SB35.2), MCU_144_IOs (U14.135)
PB6: Connectors (CN12.17 SB61.1), MCU_144_IOs (SB8.2 SB9.2 U14.136)
PB7: Connectors (CN11.21), MCU_144_IOs (SB34.2 SB68.1 U14.137)
PB8: Connectors (CN7.2 CN12.3 SB62.1), MCU_144_IOs (U14.139)
PB9: Connectors (CN7.4 CN12.5 SB55.1), MCU_144_IOs (U14.140)
PB10: Connectors (CN10.32 CN12.25), MCU_144_IOs (U14.69)
PB11: Connectors (CN10.34 CN12.18), MCU_144_IOs (U14.70)
PB12: Connectors (CN7.7 CN12.16), MCU_144_IOs (U14.73)
PB13: Connectors (CN12.30 SB7.1), MCU_144_IOs (JP6.1 U14.74)
PB14: Connectors (CN12.28 R72.1), MCU_144_IOs (U14.75)
PB15: Connectors (CN7.3 CN12.26), MCU_144_IOs (U14.76)
PC0: Connectors (CN9.3 CN11.38), MCU_144_IOs (U14.26)
PC1: Connectors (CN11.36), MCU_144_IOs (SB64.2 U14.27)
PC2: Connectors (CN11.35 SB53.1), MCU_144_IOs (U14.28)
PC3: Connectors (CN9.5 CN11.37), MCU_144_IOs (U14.29)
PC4: Connectors (CN12.34), MCU_144_IOs (SB36.2 U14.44)
PC5: Connectors (CN12.6), MCU_144_IOs (SB29.2 U14.45)
PC6: Connectors (CN7.1 CN12.4), MCU_144_IOs (U14.96)
PC7: Connectors (CN7.11 CN12.19), MCU_144_IOs (U14.97)
PC8: Connectors (CN8.2 SB14.2), MCU_144_IOs (U14.98)
PC9: Connectors (CN8.4 SB15.1), MCU_144_IOs (U14.99)
PC10: Connectors (CN8.6 CN11.1), MCU_144_IOs (U14.111)
PC11: Connectors (CN8.8 CN11.2), MCU_144_IOs (U14.112)
PC12: Connectors (CN8.10 CN11.3), MCU_144_IOs (U14.113)
PC13: Connectors (CN11.23), MCU_144_IOs (SB51.2 U14.7)
PC14: Connectors (CN11.25), MCU_144_IOs (SB41.1)
PC15: Connectors (CN11.27), MCU_144_IOs (SB40.1)
PD0: Connectors (CN9.25 CN11.57), MCU_144_IOs (U14.114)
PD1: Connectors (CN9.27 CN11.55), MCU_144_IOs (U14.115)
PD2: Connectors (CN8.12 CN11.4), MCU_144_IOs (U14.116)
PD3: Connectors (CN9.10 CN11.40), MCU_144_IOs (U14.117)
PD4: Connectors (CN9.8 CN11.39), MCU_144_IOs (U14.118)
PD5: Connectors (CN9.6 CN11.41), MCU_144_IOs (U14.119)
PD6: Connectors (CN9.4 CN11.43), MCU_144_IOs (U14.122)
PD7: Connectors (CN9.2 CN11.45), MCU_144_IOs (U14.123)
PD8: Connectors (SB82.2), MCU_144_IOs (SB18.1 SB19.1 U14.77)
PD9: Connectors (SB81.1), MCU_144_IOs (SB12.1 SB66.2 U14.78)
PD10: Connectors (CN12.65), MCU_144_IOs (SB77.1 U14.79)
PD11: Connectors (CN10.23 CN12.45), MCU_144_IOs (U14.80)
PD12: Connectors (CN10.21 CN12.43), MCU_144_IOs (U14.81)
PD13: Connectors (CN10.19 CN12.41), MCU_144_IOs (U14.82)
PD14: Connectors (CN7.16 CN12.46), MCU_144_IOs (U14.85)
PD15: Connectors (CN7.18 CN12.48), MCU_144_IOs (U14.86)
PE0: Connectors (CN10.33 CN12.64), MCU_144_IOs (U14.141)
PE1: Connectors (CN11.61 R71.1), MCU_144_IOs (U14.142)
PE2: Connectors (CN10.25 CN11.46 SB67.2), MCU_144_IOs (U14.1)
PE3: Connectors (CN9.22 CN11.47), MCU_144_IOs (U14.2)
PE4: Connectors (CN9.16 CN11.48), MCU_144_IOs (U14.3)
PE5: Connectors (CN9.18 CN11.50), MCU_144_IOs (U14.4)
PE6: Connectors (CN11.62 SB71.2 SB73.2), MCU_144_IOs (U14.5)
PE7: Connectors (CN10.20 CN12.44), MCU_144_IOs (U14.58)
PE8: Connectors (CN10.18 CN12.40), MCU_144_IOs (U14.59)
PE9: Connectors (CN12.52 SB28.2 SB70.1), MCU_144_IOs (U14.60)
PE10: Connectors (CN10.24 CN12.47), MCU_144_IOs (U14.63)
PE11: Connectors (CN10.6 CN12.56), MCU_144_IOs (U14.64)
PE12: Connectors (CN10.26 CN12.49), MCU_144_IOs (U14.65)
PE13: Connectors (CN10.10 CN12.55), MCU_144_IOs (U14.66)
PE14: Connectors (CN10.8 CN12.51), MCU_144_IOs (U14.67)
PE15: Connectors (CN10.30 CN12.53), MCU_144_IOs (U14.68)
PF0: Connectors (CN9.21 CN11.53), MCU_144_IOs (U14.10)
PF1: Connectors (CN9.19 CN11.51), MCU_144_IOs (U14.11)
PF2: Connectors (CN9.17 CN11.52), MCU_144_IOs (U14.12)
PF3: Connectors (CN7.20 CN12.58), MCU_144_IOs (U14.13)
PF4: Connectors (CN12.38 SB38.1), MCU_144_IOs (U14.14)
PF5: Connectors (CN12.36 SB48.1), MCU_144_IOs (U14.15)
PF6: Connectors (CN11.9 SB54.1), MCU_144_IOs (U14.18)
PF7: Connectors (CN9.26 CN11.11), MCU_144_IOs (U14.19)
PF8: Connectors (CN9.24 CN11.54), MCU_144_IOs (U14.20)
PF9: Connectors (CN9.28 CN11.56), MCU_144_IOs (U14.21)
PF10: Connectors (CN12.42 SB60.1), MCU_144_IOs (U14.22)
PF11: Connectors (CN12.62 SB65.1), MCU_144_IOs (U14.49)
PF12: Connectors (CN12.59 SB37.1), MCU_144_IOs (U14.50)
PF13: Connectors (CN12.57 SB49.1), MCU_144_IOs (U14.53)
PF14: Connectors (CN12.50 SB50.1), MCU_144_IOs (U14.54)
PF15: Connectors (CN12.60), MCU_144_IOs (U14.55)
PG0: Connectors (CN9.29 CN11.59), MCU_144_IOs (U14.56)
PG1: Connectors (CN9.30 CN11.58), MCU_144_IOs (U14.57)
PG2: Connectors (CN8.14 CN11.42), MCU_144_IOs (U14.87)
PG3: Connectors (CN8.16 CN11.44), MCU_144_IOs (U14.88)
PG4: Connectors (CN12.69), MCU_144_IOs (U14.89)
PG5: Connectors (CN12.68), MCU_144_IOs (U14.90)
PG6: Connectors (CN12.70 SB59.1), MCU_144_IOs (U14.91)
PG7: Connectors (CN12.67), MCU_144_IOs (SB76.2 U14.92)
PG8: Connectors (CN12.66), MCU_144_IOs (U14.93)
PG9: Connectors (CN11.63), MCU_144_IOs (U14.124)
PG10: Connectors (CN11.66), MCU_144_IOs (U14.125)
PG11: Connectors (CN11.70), MCU_144_IOs (SB27.2 U14.126)
PG12: Connectors (CN10.2 CN11.65), MCU_144_IOs (U14.127)
PG13: Connectors (CN11.68), MCU_144_IOs (SB30.2 U14.128)
PG14: Connectors (CN10.12 CN12.61), MCU_144_IOs (U14.129)
PG15: Connectors (CN11.64), MCU_144_IOs (U14.132)
PH0: Connectors (CN11.29), MCU_144_IOs (SB46.2)
PH1: Connectors (CN11.31), MCU_144_IOs (SB44.2)
RMII_CRS_DV: MCU_144_IOs (SB31.2), Ethernet (R41.1)
RMII_MDC: MCU_144_IOs (SB64.1), Ethernet (U15.13)
RMII_MDIO: MCU_144_IOs (SB72.2), Ethernet (R47.1 U15.12)
RMII_REF_CLK: MCU_144_IOs (SB57.2), Ethernet (R49.1)
RMII_RXD0: MCU_144_IOs (SB36.1), Ethernet (R44.1)
RMII_RXD1: MCU_144_IOs (SB29.1), Ethernet (R45.1)
RMII_TX_EN: MCU_144_IOs (SB27.1), Ethernet (U15.16)
RMII_TXD0: MCU_144_IOs (SB30.1), Ethernet (U15.17)
RMII_TXD1: MCU_144_IOs (JP6.2), Ethernet (U15.18)
STLK_MCO: MCU_144_IOs (SB45.2), ST_LINK_V3E (C5.2 R5.2)
T_VCP_RX: MCU_144_IOs (SB12.2 SB34.1), ST_LINK_V3E (CN5.13 R23.2 U24.1)
T_VCP_TX: MCU_144_IOs (SB9.1 SB19.2), ST_LINK_V3E (CN5.14 R3.1 U24.3)
USB_FS_ID: MCU_144_IOs (SB24.2), USB (CN13.4 U22.1)
USB_FS_N: MCU_144_IOs (SB21.2), USB (U19.1)
USB_FS_OVCR: MCU_144_IOs (SB76.1), USB (LD7.2 R61.2 U18.3)
USB_FS_P: MCU_144_IOs (SB22.2), USB (U19.3)
USB_FS_PWR_EN: MCU_144_IOs (SB77.2), USB (R56.2 U18.4)
USB_FS_VBUS: MCU_144_IOs (R60.1), USB (5 pins)

## Assembly variants
H743ZI: not fitted C62 C63 C69 C70 C71 C72 CN2 CN11 CN12 R35 R54 R55 R67 SB3 SB4 SB5 SB7 SB9 SB10 SB14 SB15 SB16 SB17 SB18 SB20 SB33 SB34 SB37 SB40 SB41 SB44 SB46 SB47 SB49 SB50 SB55 SB58 SB61 SB62 SB65 SB66 SB69 SB70 SB78 SB79 X3
H7A3ZI: not fitted C62 C63 C69 C70 C71 C72 C73 C74 C75 C76 C77 C78 C79 C80 C81 C82 C83 C85 CN2 CN11 CN12 CN14 HW3 JP6 L1 R35 R40 R41 R42 R43 R44 R45 R46 R47 R48 R49 R50 R51 R52 R53 R54 R55 R57 R58 R59 R67 R75 R76 R77 R78 SB3 SB4 SB5 SB7 SB9 SB10 SB14 SB15 SB16 SB17 SB18 SB20 SB27 SB29 SB30 SB31 SB34 SB35 SB36 SB38 SB40 SB41 SB44 SB46 SB47 SB48 SB54 SB55 SB57 SB58 SB60 SB61 SB62 SB64 SB66 SB69 SB70 SB72 SB74 SB78 SB79 U15 U16 U17 X3 X4
H7B3ZI: not fitted C62 C63 C69 C70 C71 C72 C73 C74 C75 C76 C77 C78 C79 C80 C81 C82 C83 C85 CN2 CN11 CN12 CN14 HW3 JP6 L1 R35 R40 R41 R42 R43 R44 R45 R46 R47 R48 R49 R50 R51 R52 R53 R54 R55 R57 R58 R59 R67 R75 R76 R77 R78 SB3 SB4 SB5 SB7 SB9 SB10 SB14 SB15 SB16 SB17 SB18 SB20 SB27 SB29 SB30 SB31 SB34 SB35 SB36 SB38 SB40 SB41 SB44 SB46 SB47 SB48 SB54 SB55 SB57 SB58 SB60 SB61 SB62 SB64 SB66 SB69 SB70 SB72 SB74 SB78 SB79 U15 U16 U17 X3 X4
H753ZI: not fitted C62 C63 C69 C70 C71 C72 CN2 CN11 CN12 R35 R54 R55 R67 SB3 SB4 SB5 SB7 SB9 SB10 SB14 SB15 SB16 SB17 SB18 SB20 SB33 SB34 SB37 SB40 SB41 SB44 SB46 SB47 SB49 SB50 SB55 SB58 SB61 SB62 SB65 SB66 SB69 SB70 SB78 SB79 X3